# EAGLE design ROV_PWR_4inch (EAGLE 9.2.2)
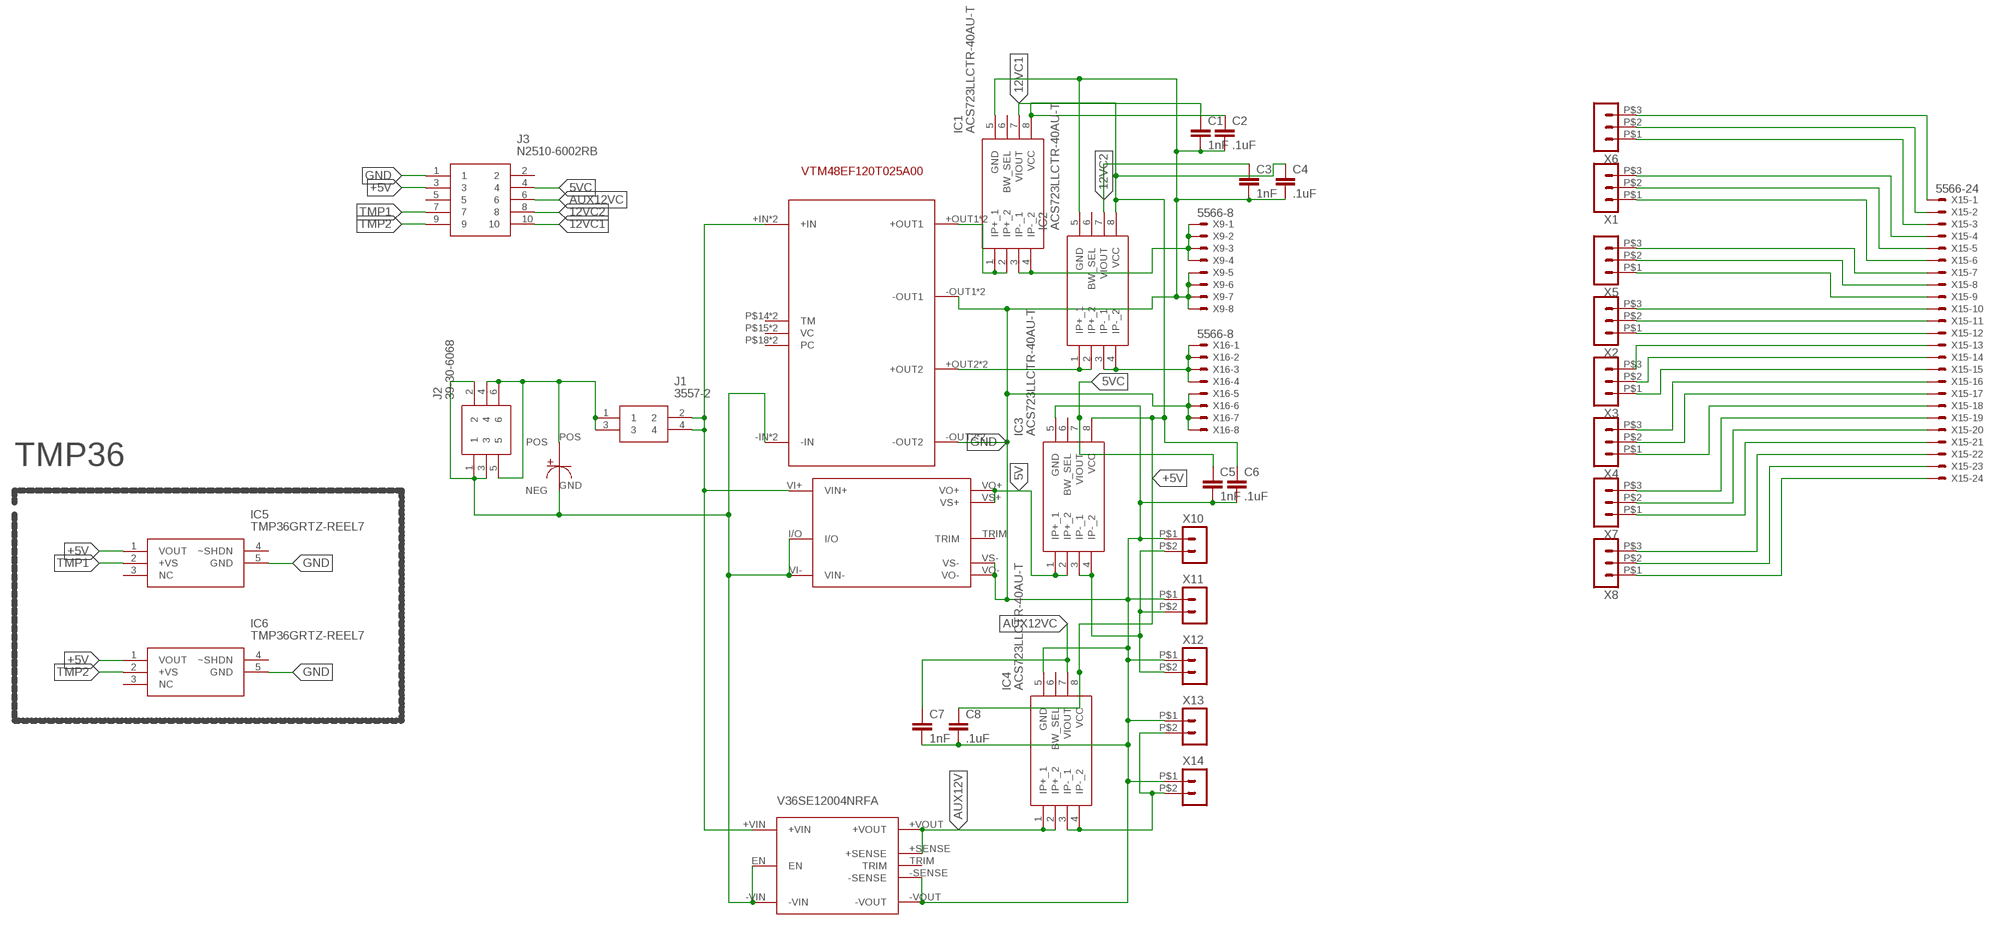
[diagram p0: schematic, sheet 1]

## Parts
C1  1nF  C-EUC0402  [C0402]
C2  .1uF  C-EUC0402  [C0402]
C3  1nF  C-EUC0402  [C0402]
C4  .1uF  C-EUC0402  [C0402]
C5  1nF  C-EUC0402  [C0402]
C6  .1uF  C-EUC0402  [C0402]
C7  1nF  C-EUC0402  [C0402]
C8  .1uF  C-EUC0402  [C0402]
IC1  ACS723LLCTR-40AU-T  [SOT127P600X175-8N]
IC2  ACS723LLCTR-40AU-T  [SOT127P600X175-8N]
IC3  ACS723LLCTR-40AU-T  [SOT127P600X175-8N]
IC4  ACS723LLCTR-40AU-T  [SOT127P600X175-8N]
IC5  TMP36GRTZ-REEL7  [SOT95P280X145-5N]
IC6  TMP36GRTZ-REEL7  [SOT95P280X145-5N]
J1  3557-2  [3557-2]
J2  39-30-6068  [39306068]
J3  N2510-6002RB  [SHDR10W64P254_2X5_2002X859X100]
U$1  VTM48EF120T025A00  [VTM48EF120T025A00]
U$2  KHHD006A0A41Z  [KHHD006A0A41Z]
U$3  V36SE12004NRFA  [V36SE12004NRFA]
U$4  UBY1V222MHL  [UBY1V222MHL]
X1  HEADER_POS3_43650-0315  [43650-0315]
X2  HEADER_POS3_43650-0315  [43650-0315]
X3  HEADER_POS3_43650-0315  [43650-0315]
X4  HEADER_POS3_43650-0315  [43650-0315]
X5  HEADER_POS3_43650-0315  [43650-0315]
X6  HEADER_POS3_43650-0315  [43650-0315]
X7  HEADER_POS3_43650-0315  [43650-0315]
X8  HEADER_POS3_43650-0315  [43650-0315]
X9  5566-8  [5566-8]
X10  HEADER_POS2_44914-0201  [44914-0201]
X11  HEADER_POS2_44914-0201  [44914-0201]
X12  HEADER_POS2_44914-0201  [44914-0201]
X13  HEADER_POS2_44914-0201  [44914-0201]
X14  HEADER_POS2_44914-0201  [44914-0201]
X15  5566-24  [5566-24]
X16  5566-8  [5566-8]

## Nets
5V: IC3.1(IP+_1) IC3.2(IP+_2) U$2.VO+ U$2.VS+
5VC: C5.1 IC3.7(VIOUT) J3.4
12VC1: C1.1 IC1.7(VIOUT) J3.10
12VC2: C3.1 IC2.7(VIOUT) J3.8
+5V: C2.1 C4.1 C6.1 C8.1 IC1.8(VCC) IC2.8(VCC) IC3.8(VCC) IC4.8(VCC) IC5.1(VOUT) IC6.1(VOUT) J3.3
AUX12V: IC4.1(IP+_1) IC4.2(IP+_2) U$3.+SENSE U$3.+VOUT
AUX12VC: C7.1 IC4.7(VIOUT) J3.6
GND: C1.2 C2.2 C3.2 C4.2 C5.2 C6.2 C7.2 C8.2 IC1.5(GND) IC2.5(GND) IC3.5(GND) IC4.5(GND) IC5.5(GND) IC6.5(GND) J3.1 U$1.-OUT1 U$1.-OUT2 U$1.P$1(-OUT1) U$1.P$4(-OUT2) U$2.VO- U$2.VS- U$3.-SENSE U$3.-VOUT X9.5 X9.6 X9.7 X9.8 X10.P$1 X11.P$1 X12.P$1 X13.P$1 X14.P$1 X16.5 X16.6 X16.7 X16.8
N$1: X6.P$3 X15.1
N$2: X6.P$2 X15.2
N$3: X6.P$1 X15.3
N$4: X1.P$3 X15.4
N$5: X1.P$2 X15.5
N$6: X1.P$1 X15.6
N$7: X5.P$3 X15.7
N$8: X5.P$2 X15.8
N$9: X5.P$1 X15.9
N$10: X2.P$3 X15.10
N$11: X2.P$2 X15.11
N$12: X2.P$1 X15.12
N$13: X3.P$3 X15.13
N$14: X3.P$2 X15.14
N$15: X3.P$1 X15.15
N$16: X4.P$3 X15.16
N$17: X4.P$2 X15.17
N$18: X4.P$1 X15.18
N$19: X7.P$3 X15.19
N$20: X7.P$2 X15.20
N$21: X7.P$1 X15.21
N$22: X8.P$3 X15.22
N$23: X8.P$2 X15.23
N$24: X8.P$1 X15.24
N$26: J1.2 J1.4 U$1.+IN U$1.P$9(+IN) U$2.VI+(VIN+) U$3.+VIN
N$27: IC1.1(IP+_1) IC1.2(IP+_2) U$1.+OUT1 U$1.P$3(+OUT1)
N$28: J2.1 J2.2 J2.3 U$1.-IN U$1.P$11(-IN) U$2.I/O U$2.VI-(VIN-) U$3.-VIN U$3.EN U$4.GND(NEG)
N$29: J1.1 J1.3 J2.4 J2.5 J2.6 U$4.POS
N$30: IC3.3(IP-_1) IC3.4(IP-_2) X10.P$2 X11.P$2 X12.P$2
N$31: IC4.3(IP-_1) IC4.4(IP-_2) X13.P$2 X14.P$2
N$32: IC2.1(IP+_1) IC2.2(IP+_2) U$1.+OUT2 U$1.P$2(+OUT2)
N$33: IC2.3(IP-_1) IC2.4(IP-_2) X16.1 X16.2 X16.3 X16.4
N$34: IC1.3(IP-_1) IC1.4(IP-_2) X9.1 X9.2 X9.3 X9.4
TMP1: IC5.2(+VS) J3.7
TMP2: IC6.2(+VS) J3.9
Unconnected: IC1.6(BW_SEL) IC2.6(BW_SEL) IC3.6(BW_SEL) IC4.6(BW_SEL) IC5.3(NC) IC5.4(~SHDN) IC6.3(NC) IC6.4(~SHDN) J3.2 J3.5 U$1.P$14(TM) U$1.P$15(VC) U$1.P$18(PC) U$1.PC U$1.TM U$1.VC U$2.TRIM U$3.TRIM

## Notes on the sheet
- TMP36

## Library data of the parts
C1-C8 = rcl:C-EU: CAPACITOR, European symbol; SPICEPREFIX: C
IC1-IC4 = SamacSys_Parts:ACS723LLCTR-40AU-T: SENSOR CURRENT HALL 40A DC Source: Datasheet <http://www.allegromicro.com/~/media/Files/Datasheets/ACS723-Datasheet.ashx>; DESCRIPTION: SENSOR CURRENT HALL 40A DC; HEIGHT: 1.75mm; MANUFACTURER_NAME: Allegro Microsystems; MANUFACTURER_PART_NUMBER: ACS723LLCTR-40AU-T
IC5 IC6 = SamacSys_Parts:TMP36GRTZ-REEL7: Analog Devices TMP36GRTZ-REEL7 Temperature Sensor 5-Pin SOT-23, -40 +125 C Source: Datasheet <https://componentsearchengine.com/Datasheets/1/TMP36GRTZ-REEL7.pdf>; DESCRIPTION: Analog Devices TMP36GRTZ-REEL7 Temperature Sensor 5-Pin SOT-23, -40 +125 C; HEIGHT: mm; MANUFACTURER_NAME: Analog Devices; MANUFACTURER_PART_NUMBER: TMP36GRTZ-REEL7; MOUSER_PART_NUMBER: 584-TMP36GRTZ-R7
J1 = SamacSys_Parts:3557-2: THM 2 in 1 Auto Blade Holder P/N 3557-2 Source: Datasheet <https://componentsearchengine.com/Datasheets/1/3557-2.pdf>; DESCRIPTION: THM 2 in 1 Auto Blade Holder P/N 3557-2; HEIGHT: mm; MANUFACTURER_NAME: Keystone Electronics; MANUFACTURER_PART_NUMBER: 3557-2; MOUSER_PART_NUMBER: 534-3557-2
J2 = SamacSys_Parts:39-30-6068: Headers & Wire Housings MiniFit Vert Hdr Ass Assy 6Ckt 94V-0 Tin Source: Datasheet <https://componentsearchengine.com/Datasheets/1/39-30-6068.pdf>; DESCRIPTION: Headers & Wire Housings MiniFit Vert Hdr Ass Assy 6Ckt 94V-0 Tin; HEIGHT: 12.8mm; MANUFACTURER_NAME: Molex; MANUFACTURER_PART_NUMBER: 39-30-6068; MOUSER_PART_NUMBER: 538-39-30-6068
J3 = SamacSys_Parts:N2510-6002RB: 3M 10W ST BOX HDR CLASS 2 3M 2500 Series, 2.54mm Pitch 10 Way 2 Row Straight PCB Header, Solder Termination, 2A Source: Datasheet <https://componentsearchengine.com/Datasheets/1/N2510-6002RB.pdf>; DESCRIPTION: 3M 10W ST BOX HDR CLASS 2 3M 2500 Series, 2.54mm Pitch 10 Way 2 Row Straight PCB Header, Solder Termination, 2A; HEIGHT: 10.04mm; MANUFACTURER_NAME: 3M; MANUFACTURER_PART_NUMBER: N2510-6002RB; MOUSER_PART_NUMBER: 517-N2510-6002RB
U$1 = VTM48EF120T025A00:VTM48EF120T025A00
U$2 = KHHD006A0A41Z:KHHD006A0A41Z
U$3 = V36SE12004NRFA:V36SE12004NRFA
U$4 = UBY1V222MHL:UBY1V222MHL
X1-X8 = con-molex-micro-fit-3_0:HEADER_POS3_?: Molex - Micro-Fit 3.0 Series connector, 3.00mm (0.118") pitch header, 3 positions.
X9 X16 = con-molex:5566-8: Mini FIT connector 8 pol Source: http://www.molex.com; MF: MOLEX; OC_FARNELL: unknown; OC_NEWARK: unknown
X10-X14 = con-molex-micro-fit-3_0:HEADER_POS2_?: Molex - Micro-Fit 3.0 Series connector, 3.00mm (0.118") pitch header, 2 positions.
X15 = con-molex:5566-24: Mini FIT connector 24 pol Source: http://www.molex.com; MF: MOLEX; OC_FARNELL: unknown; OC_NEWARK: unknown

## Board
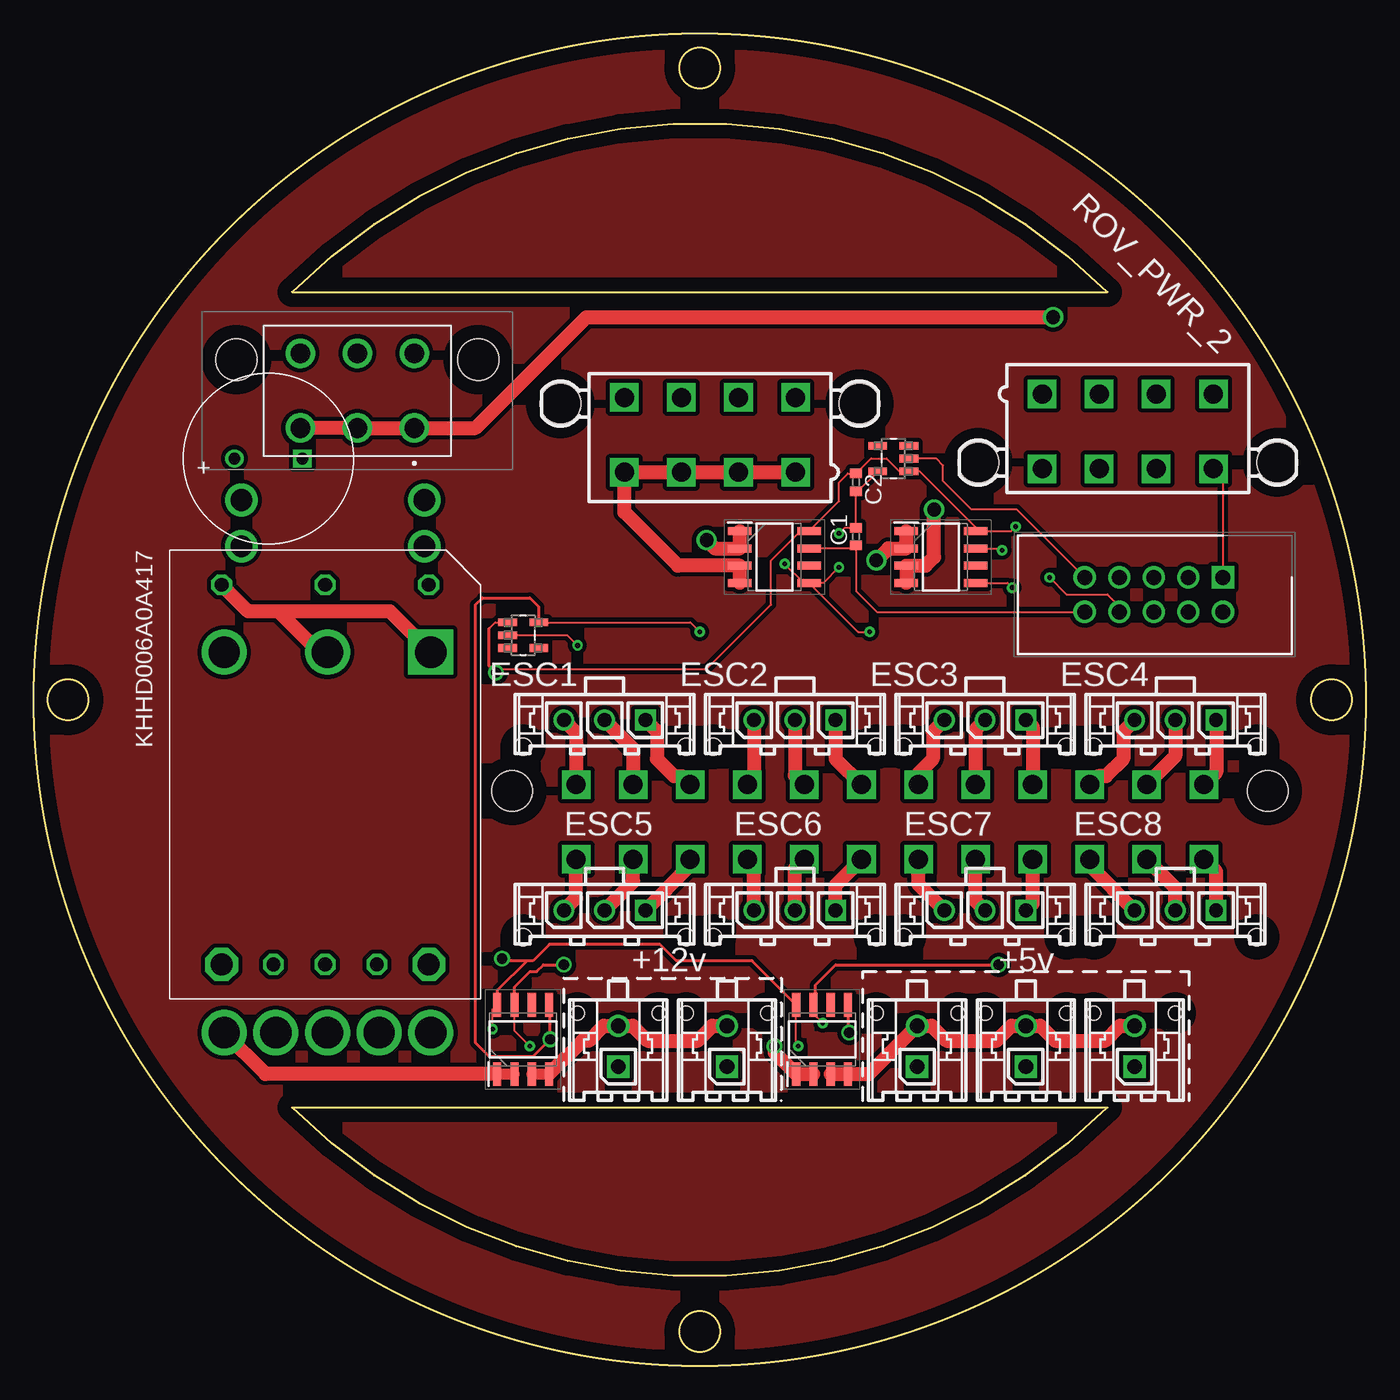
[diagram p1: board, top side]
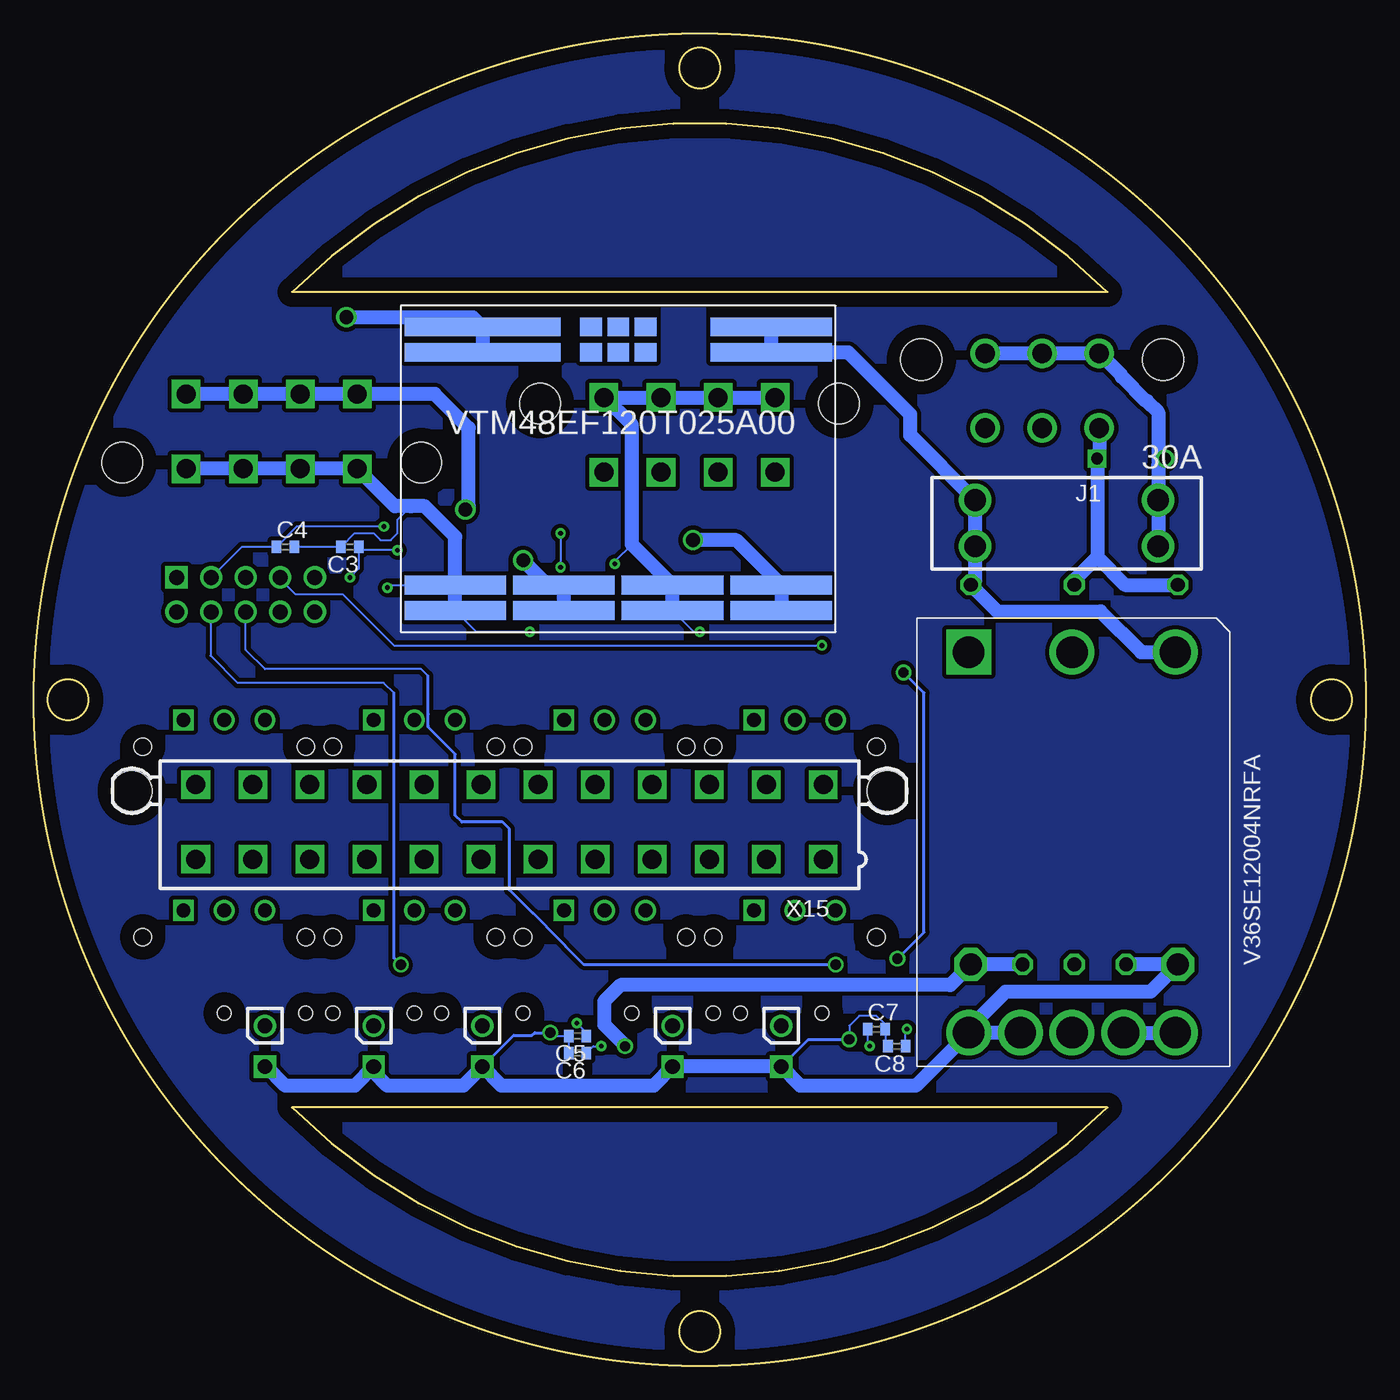
[diagram p2: board, bottom side, seen from below]

Size 98 x 98 mm. Coordinates in mm from the lower left corner, seen from the top.
Outline: 79,19 arc-90 19,19 79,19
Outline: 19,79 arc-90 79,79 19,79
Outline: circle at 49,49 radius 49
Outline: circle at 49,95.5 radius 1.5
Outline: circle at 95.5,49 radius 1.5
Outline: circle at 49,2.5 radius 1.5
Outline: circle at 2.5,49 radius 1.5
Copper layers (1*16): Top 0.035mm / dielectric 1.5mm / Bottom 0.035mm
Design rules "default": minimum track width 6mil, minimum drill 0.35mm, track to track 6mil, track to pad 6mil, pad to pad 6mil, via to via 6mil, smd to smd 6mil, copper to edge 40mil, drill to drill 6mil, minimum pad ring 10mil, minimum via ring 8mil, stop-mask expansion 4mil, vias tented up to drill 0mil, thermal gap 10mil

### Footprints (pad centres in the part's own frame; a part is rotated, then mirrored left to right if it is on the bottom)
C0402 = smd 0.7 x 0.9: 1 -0.65,0; 2 0.65,0
SOT127P600X175-8N = smd 1.75 x 0.6: 1 -2.55,1.905; 2 -2.55,0.635; 3 -2.55,-0.635; 4 -2.55,-1.905; 5 2.55,-1.905; 6 2.55,-0.635; 7 2.55,0.635; 8 2.55,1.905
SOT95P280X145-5N = smd 1.372 x 0.559: 1 -1.143,0.94; 2 -1.143,0; 3 -1.143,-0.94; 4 1.143,-0.94; 5 1.143,0.94
3557-2 = drill 1.6 pad 2.4: 1 -6.735,1.7; 2 6.735,1.7; 3 -6.735,-1.7; 4 6.735,-1.7
39306068 = drill 1.45 pad 2.175: 1 0,0; 2 -4.2,0; 3 -8.4,0; 4 0,5.5; 5 -4.2,5.5; 6 -8.4,5.5 | hole 3.05: -13.1,5.04; 4.7,5.04
SHDR10W64P254_2X5_2002X859X100 = drill 1.1 pad 1.65 square: 1 0,0 | drill 1.1 pad 1.65: 2 0,2.54; 3 2.54,0; 4 2.54,2.54; 5 5.08,0; 6 5.08,2.54; 7 7.62,0; 8 7.62,2.54; 9 10.16,0; 10 10.16,2.54
VTM48EF120T025A00 = smd 1.38 x 8.94: +IN -10.44,11.27; P$9 -8.56,11.27 | smd 1.38 x 7.48: +OUT1 10.44,12; +OUT2 10.44,-4; -OUT1 10.44,4; -OUT2 10.44,-12; P$1 8.56,4; P$2 8.56,-4; P$3 8.56,12; P$4 8.56,-12 | smd 1.38 x 11.48: -IN -10.44,-10; P$11 -8.56,-10 | smd 1.38 x 1.6: P$14 -8.56,2; P$15 -8.56,0; P$18 -8.56,-2; PC -10.44,-2; TM -10.44,2; VC -10.44,0
KHHD006A0A41Z = drill 1.016 octagon: I/O 2.54,11.43; TRIM 30.48,11.43; VI+ 2.54,19.05; VI- 2.54,3.81; VS+ 30.48,15.24; VS- 30.48,7.62 | drill 1.6 octagon: VO+ 30.48,19.05; VO- 30.48,3.81
V36SE12004NRFA = drill 2.3: +SENSE 30.5,15.2; +VIN 2.5,19; +VOUT 30.5,19; -SENSE 30.5,7.6; -VOUT 30.5,3.8; EN 2.5,11.4; TRIM 30.5,11.4 | drill 2.3 square: -VIN 2.5,3.8
UBY1V222MHL = drill 0.85 square: GND -2.5,0 | drill 0.85: POS 2.5,0
43650-0315 = drill 1.02 square: P$1 3,0 | drill 1.02: P$2 0,0; P$3 -3,0 | hole 1.27: 6,-1.96; -6,-1.96
5566-8 = drill 1.4 square: 1 6.3,-2.75; 2 2.1,-2.75; 3 -2.1,-2.75; 4 -6.3,-2.75; 5 6.3,2.75; 6 2.1,2.75; 7 -2.1,2.75; 8 -6.3,2.75 | hole 3: 11,2.29; -11,2.29
44914-0201 = drill 1.09 square: P$1 0,0 | drill 1.09: P$2 0,3 | hole 1.02: 3,3.94; -3,3.94
5566-24 = drill 1.4 square: 1 23.1,-2.75; 2 18.9,-2.75; 3 14.7,-2.75; 4 10.5,-2.75; 5 6.3,-2.75; 6 2.1,-2.75; 7 -2.1,-2.75; 8 -6.3,-2.75; 9 -10.5,-2.75; 10 -14.7,-2.75; 11 -18.9,-2.75; 12 -23.1,-2.75; 13 23.1,2.75; 14 18.9,2.75; 15 14.7,2.75; 16 10.5,2.75; 17 6.3,2.75; 18 2.1,2.75; 19 -2.1,2.75; 20 -6.3,2.75; 21 -10.5,2.75; 22 -14.7,2.75; 23 -18.9,2.75; 24 -23.1,2.75 | hole 3: 27.8,2.29; -27.8,2.29

### Placement (x,y rotation side)
C1  60.5,61 90 top
C2  60.5,65 270 top
C3  74.75,60.25 180 bottom
C4  79.5,60.25 0 bottom
C5  58,24.25 180 bottom
C6  58,23 180 bottom
C7  36,24.75 0 bottom
C8  34.5,23.5 180 bottom
IC1  54.5,59.5 0 top
IC2  66.75,59.5 0 top
IC3  58,24 90 top
IC4  36,24 90 top
IC5  36,53.75 0 top
IC6  63.25,66.75 180 top
J1  22,62 180 bottom
J2  28,69 0 top
J3  87.5,58 180 top
U$1  55,66 270 bottom
U$2  10,60 270 top
U$3  33,55 270 bottom
U$4  17.25,66.75 180 top
X1  56,33.5 0 top
X2  84,33.5 0 top
X3  42,47.5 0 top
X4  56,47.5 0 top
X5  70,33.5 0 top
X6  42,33.5 0 top
X7  70,47.5 0 top
X8  84,47.5 0 top
X9  49.75,68.5 0 top
X10  81,22 0 top
X11  73,22 0 top
X12  65,22 0 top
X13  51,22 0 top
X14  43,22 0 top
X15  63,40 0 bottom
X16  80.5,68.75 180 top

### Tracks (layer width: path | path; a pad name or v marks a point on that pad's centre or on a via)
5V  (via drill 0.75)
  Top 1.016: IC3.2 IC3.1 54.5,23.05 v54.5,23.5
  Bottom 1.016: v54.5,23.5 54.5,23.56 56.03,25.1 56.03,26.78 54.82,28 30.57,28 U$2.VO+ U$2.VS+
5VC  (via drill 0.35, 0.75)
  Top 0.152: v58.05,25.2 57.37,25.89 IC3.7
  Top 0.203: IC3.7 57.5,26.68 57.5,28 59,29.5 v71,29.5
  Bottom 0.152: C5.1 57.35,24.5 v58.05,25.2 | 71.5,49.5 72.25,50.25 83,50.25 85,52.25 84.96,52.29 J3.4
  Bottom 0.203: v71,29.5 71.5,30 71.5,49.5
12VC1
  Top 0.152: IC1.7 60.28,60.13 C1.1 60.5,57 62.04,55.46 J3.10
12VC2  (via drill 0.35)
  Top 0.152: IC2.7 71.11,60.13 v71.25,60 | v74.75,58 76,56.75 79,56.75 79.88,55.87 J3.8
  Bottom 0.152: v71.25,60 73.85,60 C3.1 74.1,58.65 v74.75,58
+5V  (via drill 0.35, 0.75)
  Top 0.152: v56.25,23.5 56.09,23.66 IC3.8 | v33.75,24.75 33.75,26.2 IC4.8 | v34,51 34.25,51.25 49.5,51.25 54.25,56 54.25,59.25 56.41,61.41 IC1.8 59.25,63.61 59.25,65 59.9,65.65 C2.1 61.6,66.75 62.75,66.75 63.69,65.81 IC6.1 65.19,65.81 69.3,61.7 IC2.8 71.91,61.41 v72.25,61.75 | 33.5,54.25 33.94,54.69 IC5.1
  Top 0.203: IC3.8 52.86,29.79 47.27,29.79 46.06,31 37.94,31 36.73,29.79 36.29,29.79 | IC4.8 34.09,27.59 36.29,29.79 | 36.29,29.79 34.6,29.79 v34.44,29.94 | v34,51 33.5,51.5 33.5,54.25
  Bottom 0.152: C6.1 56.85,23.5 v56.25,23.5 | C8.1 33.85,24.65 v33.75,24.75 | J3.3 82.71,60.25 C4.1 78.65,61.75 v72.25,61.75
  Bottom 0.203: v34.44,29.94 32.5,31.89 32.5,49.5 v34,51
AUX12V
  Top 0.813: IC4.1 IC4.2
  Top 1.016: IC4.1 17.05,21.45 U$3.+VOUT
  Bottom 1.016: U$3.+SENSE U$3.+VOUT
AUX12VC  (via drill 0.35, 0.75)
  Top 0.152: v36.5,23.5 35.37,24.64 IC4.7
  Top 0.203: IC4.7 35.37,27.86 36.5,29 37,29 37.5,29.5 v39,29.5
  Bottom 0.152: C7.1 36.65,23.65 v36.5,23.5 | 69,50.75 69.5,51.25 81,51.25 82.42,52.67 J3.6
  Bottom 0.203: v39,29.5 57.5,29.5 60.25,32.25 60.25,32.27 61.27,33.29 61.29,33.29 63,35 63,39.5 63.5,40 66.5,40 67,40.5 67,45 69,47 69,47.06 68.98,47.08 68.98,47.92 69,47.94 69,50.75
BOTTOM
  pour Bottom (isolate 0.305): -1,49 arc-90 49,99 arc-90 99,49 arc-90 49,-1 arc-90
GND  (via drill 0.35, 0.75)
  Top 0.152: v59.25,61.25 59.65,61.65 C1.2 C2.2 60.65,64.35 IC6.5 | v59.25,58.75 58.09,57.59 IC1.5 | IC1.5 60.64,54 v61.5,54 | v55.25,59 56.66,57.59 IC1.5 | X16.8 87.5,65.3 J3.1 | IC2.5 71.66,57.59 v72,57.25 | IC5.5 48.31,54.69 v49,54
  Top 0.203: v60,24.5 59.91,24.59 IC3.5 | IC4.5 37.91,26.59 38,26.5 v38,24 36.75,22.75 33.5,22.75 32.5,23.75 32.5,56 33,56.5 36.5,56.5 37.14,55.86 IC5.5
  Bottom 0.152: v60,24.5 59.75,24.25 C5.2 C6.2 | v38,24 38,25 37.25,25.75 36,25.75 35.35,25.1 C7.2 35.35,23.7 C8.2 | C4.2 C3.2 74.4,61.25 73,61.25 72.5,60.75 71.75,60.75 71.25,61.25 71.25,62.25 70.25,63.25 | v59.25,61.25 v59.25,58.75 | v61.5,54 65.44,54 U$1.-OUT2 | 54,60.44 55.25,59.19 v55.25,59 | v72,57.25 71.81,57.44 U$1.P$4 | v49,54 49.44,54 U$1.-OUT1
  Bottom 0.203: v60,24.5 61.14,24.5 61.33,24.31 62.69,24.31 X12.P$1 | X14.P$1 41,24 v38,24
  Bottom 1.016: 29.2,24.8 26.5,27.5 15.83,27.5 U$2.VO- U$2.VS- | 29.2,24.8 U$3.-VOUT 33.1,20.6 41.6,20.6 X14.P$1 X13.P$1 52.4,20.6 63.6,20.6 X12.P$1 66.4,20.6 72,20.6 73,21.6 X11.P$1 74.4,20.6 79.5,20.6 80.9,22 X10.P$1 | U$3.-SENSE 28.9,24.5 29.2,24.8 | X9.8 X9.7 X9.6 X9.5 56,71.25 54,69.25 54,60.44 U$1.P$1 U$1.-OUT1 | U$1.-OUT2 U$1.P$4 67,61 69.25,63.25 70.25,63.25 71.45,63.25 X16.5 X16.6 X16.7 X16.8
N$1
  Top 1.016: X6.P$3 39.9,34.4 X15.1
N$2
  Top 1.016: X6.P$2 44.1,35.6 X15.2
N$3
  Top 1.016: X6.P$1 48.3,36.8 X15.3
N$4
  Top 1.016: X1.P$3 53,36.75 X15.4
N$5
  Top 1.016: X1.P$2 56,36.55 X15.5
N$6
  Top 1.016: X1.P$1 59,35.35 X15.6
N$7
  Top 1.016: X5.P$3 65.1,35.4 X15.7
N$8
  Top 1.016: X5.P$2 69.3,34.2 X15.8
N$9
  Top 1.016: X5.P$1 73.5,34 X15.9
N$10
  Top 1.016: X2.P$3 77.7,36.8 X15.10
N$11
  Top 1.016: X2.P$2 84,35.15 X15.11
N$12
  Top 1.016: X2.P$1 87,36.35 X15.12
N$13
  Top 1.016: X3.P$3 39.9,46.6 X15.13
N$14
  Top 1.016: X3.P$2 44.1,45.4 X15.14
N$15
  Top 1.016: X3.P$1 45.84,46.66 45.84,44.65 47.11,43.38 47.67,43.38 X15.15
N$16
  Top 1.016: X4.P$3 53,43.25 X15.16
N$17
  Top 1.016: X4.P$2 56,43.45 X15.17
N$18
  Top 1.016: X4.P$1 59,44.65 X15.18
N$19
  Top 1.016: X15.19 65.1,43.59 66.16,44.65 66.16,46.66 X7.P$3
N$20
  Top 1.016: X7.P$2 69.3,46.8 X15.20
N$21
  Top 1.016: X7.P$1 73.5,47 X15.21
N$22
  Top 1.016: X8.P$3 80.16,46.66 80.16,44.65 78.89,43.38 78.33,43.38 X15.22
N$23
  Top 1.016: X8.P$2 84,44.85 X15.23
N$24
  Top 1.016: X8.P$1 87,43.65 X15.24
N$26
  Bottom 1.016: U$1.+IN U$1.P$9 38.06,74.56 33.5,70 33.5,68.47 J1.4 J1.2 28.73,57.77 U$2.VI+ 27.09,55.5 19.5,55.5 16.5,52.5 U$3.+VIN
N$27  (via drill 1)
  Top 1.016: v49.5,60.75 50.12,60.13 IC1.2 IC1.1
  Bottom 1.016: U$1.+OUT1 U$1.P$3 46.31,60.75 v49.5,60.75
N$28  (via drill 1)
  Top 1.016: U$3.-VIN 26.2,55.5 18,55.5 | U$2.VI- 15.77,55.5 18,55.5 | U$3.EN 21,52.5 18,55.5 | J2.3 J2.2 J2.1 32.5,69 40.66,77.16 v75,77.16
  Bottom 1.016: v75,77.16 65.72,77.16 U$1.-IN U$1.P$11 | J2.3 19.6,66.9 U$4.GND 19.75,59.5 | U$2.VI- 17.71,57.46 19.75,59.5 | U$2.I/O 21.43,57.82 19.75,59.5
N$29
  Bottom 1.016: J2.4 J2.5 J2.6 17.95,72.85 17.95,72.78 16.16,70.99 16.09,70.99 15.27,70.16 J1.3 | J1.3 J1.1 | U$4.POS 15.27,66.23 J1.3
N$30
  Top 1.016: IC3.3 IC3.4 61.45,21.45 X12.P$2 66.06,25 67.16,23.91 70.84,23.91 71.94,25 X11.P$2 74.06,25 75.16,23.91 78.84,23.91 79.94,25 X10.P$2
N$31
  Top 0.813: IC4.3 IC4.4
  Top 1.016: X13.P$2 49.94,25 48.84,23.91 45.16,23.91 44.06,25 X14.P$2 41.94,25 40.84,23.91 40.36,23.91 IC4.4
N$32  (via drill 1)
  Top 1.016: v62,59.25 62.88,60.13 IC2.2 IC2.1
  Bottom 1.016: U$1.+OUT2 U$1.P$2 60.19,57.44 v62,59.25
N$33  (via drill 1)
  Top 1.016: IC2.4 IC2.3 65.61,58.87 66.25,59.5 v66.25,63
  Bottom 1.016: v66.25,63 66,63.25 66,69 68.5,71.5 X16.1 X16.2 X16.3 X16.4
N$34
  Top 1.016: IC1.4 IC1.3 47.38,58.87 43.45,62.8 X9.4 X9.3 X9.2 X9.1
TMP1  (via drill 0.35)
  Top 0.152: IC5.2 39.25,53.75 v40,53
  Bottom 0.152: J3.7 79.88,57.88 78.75,56.75 75.25,56.75 71.5,53 v40,53
TMP2
  Top 0.152: J3.9 72.34,63 69,63 66.91,65.09 66.91,66.25 66.41,66.75 65.5,66.75 65.39,66.75 IC6.2
TOP
  pour Top (isolate 0.305): -1,49 arc-90 49,99 arc-90 99,49 arc-90 49,-1 arc-90

### Text on the board
tNames: ROV_PWR_2 | ESC1 | ESC2 | ESC3 | ESC4 | ESC5 | ESC6 | ESC7 | ESC8 | +12v | +5v
bNames: 30A